# EAGLE schematic display driver rev A (EAGLE 9.3.1)
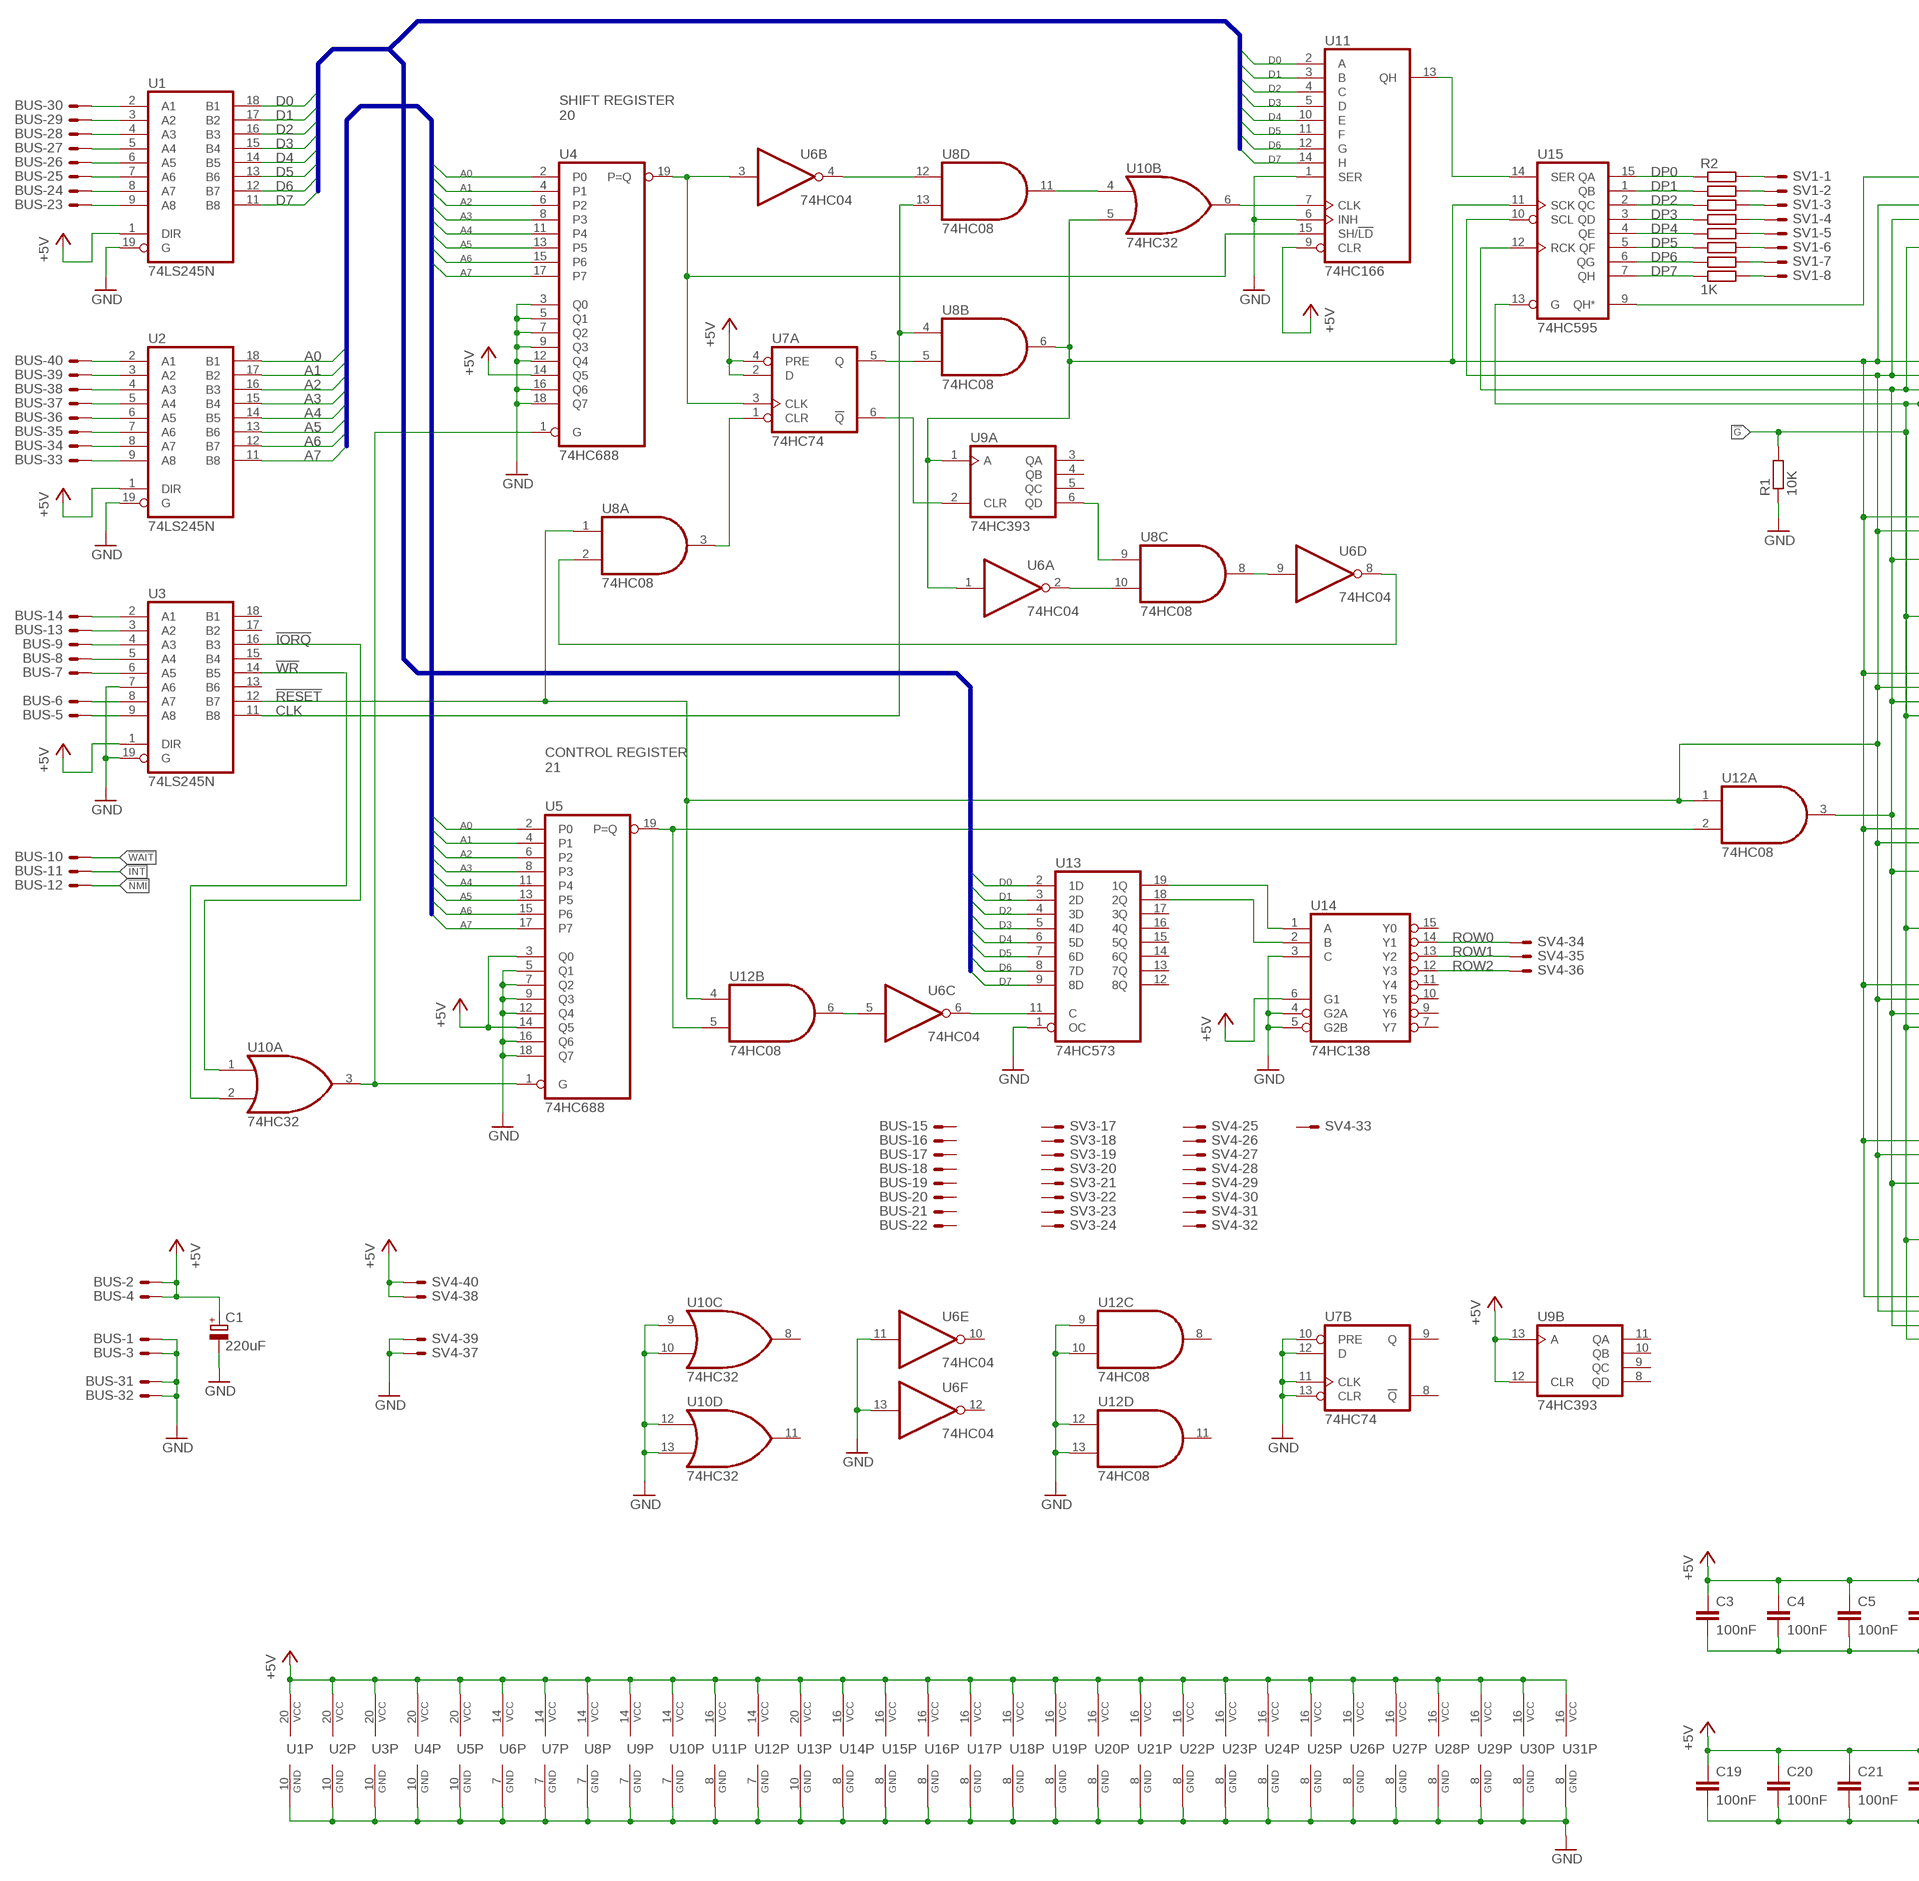
[diagram p0: schematic, sheet 1, part 1 of 2]
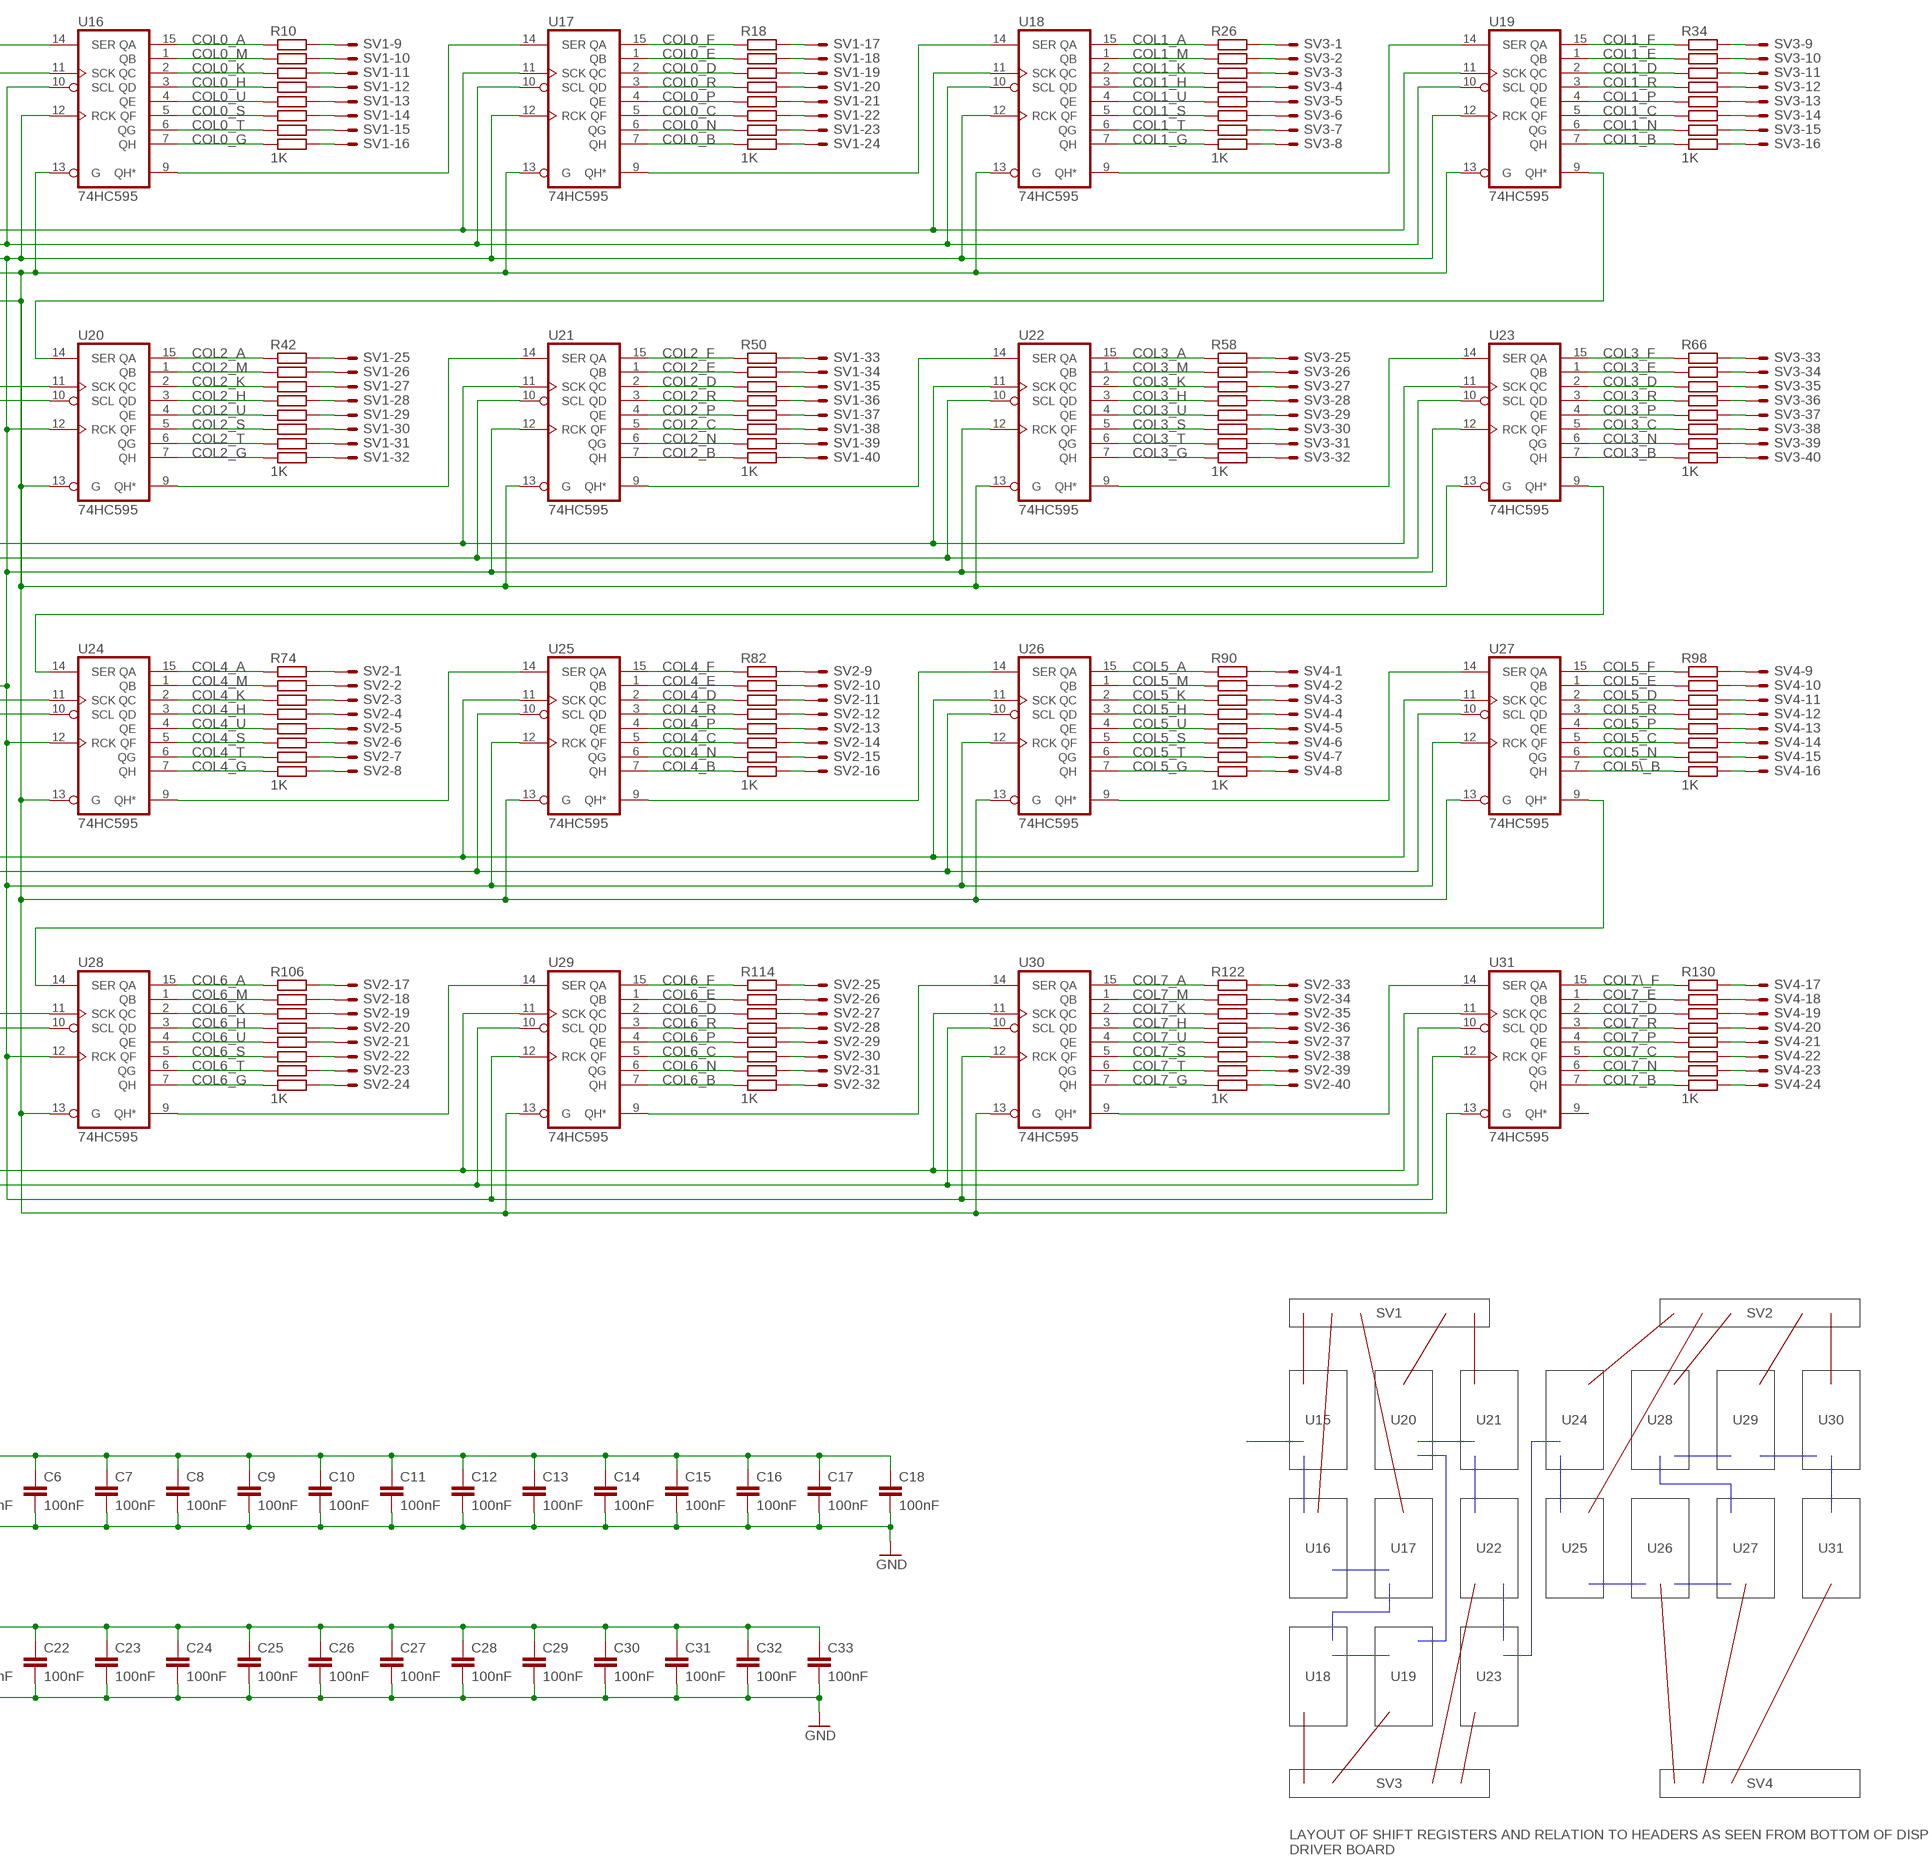
[diagram p1: schematic, sheet 1, part 2 of 2]

## Parts
BUS  ML40E  [ML40]
C1  220uF  CPOL-EUE3.5-8  [E3,5-8]
C3  100nF  C-EU050-025X075  [C050-025X075]
C4  100nF  C-EU050-025X075  [C050-025X075]
C5  100nF  C-EU050-025X075  [C050-025X075]
C6  100nF  C-EU050-025X075  [C050-025X075]
C7  100nF  C-EU050-025X075  [C050-025X075]
C8  100nF  C-EU050-025X075  [C050-025X075]
C9  100nF  C-EU050-025X075  [C050-025X075]
C10  100nF  C-EU050-025X075  [C050-025X075]
C11  100nF  C-EU050-025X075  [C050-025X075]
C12  100nF  C-EU050-025X075  [C050-025X075]
C13  100nF  C-EU050-025X075  [C050-025X075]
C14  100nF  C-EU050-025X075  [C050-025X075]
C15  100nF  C-EU050-025X075  [C050-025X075]
C16  100nF  C-EU050-025X075  [C050-025X075]
C17  100nF  C-EU050-025X075  [C050-025X075]
C18  100nF  C-EU050-025X075  [C050-025X075]
C19  100nF  C-EU050-025X075  [C050-025X075]
C20  100nF  C-EU050-025X075  [C050-025X075]
C21  100nF  C-EU050-025X075  [C050-025X075]
C22  100nF  C-EU050-025X075  [C050-025X075]
C23  100nF  C-EU050-025X075  [C050-025X075]
C24  100nF  C-EU050-025X075  [C050-025X075]
C25  100nF  C-EU050-025X075  [C050-025X075]
C26  100nF  C-EU050-025X075  [C050-025X075]
C27  100nF  C-EU050-025X075  [C050-025X075]
C28  100nF  C-EU050-025X075  [C050-025X075]
C29  100nF  C-EU050-025X075  [C050-025X075]
C30  100nF  C-EU050-025X075  [C050-025X075]
C31  100nF  C-EU050-025X075  [C050-025X075]
C32  100nF  C-EU050-025X075  [C050-025X075]
C33  100nF  C-EU050-025X075  [C050-025X075]
R1  10K  R-EU_0207/10  [0207/10]
R2  1K  R-EU_0207/10  [0207/10]
R3  1K  R-EU_0207/10  [0207/10]
R4  1K  R-EU_0207/10  [0207/10]
R5  1K  R-EU_0207/10  [0207/10]
R6  1K  R-EU_0207/10  [0207/10]
R7  1K  R-EU_0207/10  [0207/10]
R8  1K  R-EU_0207/10  [0207/10]
R9  1K  R-EU_0207/10  [0207/10]
R10  1K  R-EU_0207/10  [0207/10]
R11  1K  R-EU_0207/10  [0207/10]
R12  1K  R-EU_0207/10  [0207/10]
R13  1K  R-EU_0207/10  [0207/10]
R14  1K  R-EU_0207/10  [0207/10]
R15  1K  R-EU_0207/10  [0207/10]
R16  1K  R-EU_0207/10  [0207/10]
R17  1K  R-EU_0207/10  [0207/10]
R18  1K  R-EU_0207/10  [0207/10]
R19  1K  R-EU_0207/10  [0207/10]
R20  1K  R-EU_0207/10  [0207/10]
R21  1K  R-EU_0207/10  [0207/10]
R22  1K  R-EU_0207/10  [0207/10]
R23  1K  R-EU_0207/10  [0207/10]
R24  1K  R-EU_0207/10  [0207/10]
R25  1K  R-EU_0207/10  [0207/10]
R26  1K  R-EU_0207/10  [0207/10]
R27  1K  R-EU_0207/10  [0207/10]
R28  1K  R-EU_0207/10  [0207/10]
R29  1K  R-EU_0207/10  [0207/10]
R30  1K  R-EU_0207/10  [0207/10]
R31  1K  R-EU_0207/10  [0207/10]
R32  1K  R-EU_0207/10  [0207/10]
R33  1K  R-EU_0207/10  [0207/10]
R34  1K  R-EU_0207/10  [0207/10]
R35  1K  R-EU_0207/10  [0207/10]
R36  1K  R-EU_0207/10  [0207/10]
R37  1K  R-EU_0207/10  [0207/10]
R38  1K  R-EU_0207/10  [0207/10]
R39  1K  R-EU_0207/10  [0207/10]
R40  1K  R-EU_0207/10  [0207/10]
R41  1K  R-EU_0207/10  [0207/10]
R42  1K  R-EU_0207/10  [0207/10]
R43  1K  R-EU_0207/10  [0207/10]
R44  1K  R-EU_0207/10  [0207/10]
R45  1K  R-EU_0207/10  [0207/10]
R46  1K  R-EU_0207/10  [0207/10]
R47  1K  R-EU_0207/10  [0207/10]
R48  1K  R-EU_0207/10  [0207/10]
R49  1K  R-EU_0207/10  [0207/10]
R50  1K  R-EU_0207/10  [0207/10]
R51  1K  R-EU_0207/10  [0207/10]
R52  1K  R-EU_0207/10  [0207/10]
R53  1K  R-EU_0207/10  [0207/10]
R54  1K  R-EU_0207/10  [0207/10]
R55  1K  R-EU_0207/10  [0207/10]
R56  1K  R-EU_0207/10  [0207/10]
R57  1K  R-EU_0207/10  [0207/10]
R58  1K  R-EU_0207/10  [0207/10]
R59  1K  R-EU_0207/10  [0207/10]
R60  1K  R-EU_0207/10  [0207/10]
R61  1K  R-EU_0207/10  [0207/10]
R62  1K  R-EU_0207/10  [0207/10]
R63  1K  R-EU_0207/10  [0207/10]
R64  1K  R-EU_0207/10  [0207/10]
R65  1K  R-EU_0207/10  [0207/10]
R66  1K  R-EU_0207/10  [0207/10]
R67  1K  R-EU_0207/10  [0207/10]
R68  1K  R-EU_0207/10  [0207/10]
R69  1K  R-EU_0207/10  [0207/10]
R70  1K  R-EU_0207/10  [0207/10]
R71  1K  R-EU_0207/10  [0207/10]
R72  1K  R-EU_0207/10  [0207/10]
R73  1K  R-EU_0207/10  [0207/10]
R74  1K  R-EU_0207/10  [0207/10]
R75  1K  R-EU_0207/10  [0207/10]
R76  1K  R-EU_0207/10  [0207/10]
R77  1K  R-EU_0207/10  [0207/10]
R78  1K  R-EU_0207/10  [0207/10]
R79  1K  R-EU_0207/10  [0207/10]
R80  1K  R-EU_0207/10  [0207/10]
R81  1K  R-EU_0207/10  [0207/10]
R82  1K  R-EU_0207/10  [0207/10]
R83  1K  R-EU_0207/10  [0207/10]
R84  1K  R-EU_0207/10  [0207/10]
R85  1K  R-EU_0207/10  [0207/10]
R86  1K  R-EU_0207/10  [0207/10]
R87  1K  R-EU_0207/10  [0207/10]
R88  1K  R-EU_0207/10  [0207/10]
R89  1K  R-EU_0207/10  [0207/10]
R90  1K  R-EU_0207/10  [0207/10]
R91  1K  R-EU_0207/10  [0207/10]
R92  1K  R-EU_0207/10  [0207/10]
R93  1K  R-EU_0207/10  [0207/10]
R94  1K  R-EU_0207/10  [0207/10]
R95  1K  R-EU_0207/10  [0207/10]
R96  1K  R-EU_0207/10  [0207/10]
R97  1K  R-EU_0207/10  [0207/10]
R98  1K  R-EU_0207/10  [0207/10]
R99  1K  R-EU_0207/10  [0207/10]
R100  1K  R-EU_0207/10  [0207/10]
R101  1K  R-EU_0207/10  [0207/10]
R102  1K  R-EU_0207/10  [0207/10]
R103  1K  R-EU_0207/10  [0207/10]
R104  1K  R-EU_0207/10  [0207/10]
R105  1K  R-EU_0207/10  [0207/10]
R106  1K  R-EU_0207/10  [0207/10]
R107  1K  R-EU_0207/10  [0207/10]
R108  1K  R-EU_0207/10  [0207/10]
R109  1K  R-EU_0207/10  [0207/10]
R110  1K  R-EU_0207/10  [0207/10]
R111  1K  R-EU_0207/10  [0207/10]
R112  1K  R-EU_0207/10  [0207/10]
R113  1K  R-EU_0207/10  [0207/10]
R114  1K  R-EU_0207/10  [0207/10]
R115  1K  R-EU_0207/10  [0207/10]
R116  1K  R-EU_0207/10  [0207/10]
R117  1K  R-EU_0207/10  [0207/10]
R118  1K  R-EU_0207/10  [0207/10]
R119  1K  R-EU_0207/10  [0207/10]
R120  1K  R-EU_0207/10  [0207/10]
R121  1K  R-EU_0207/10  [0207/10]
R122  1K  R-EU_0207/10  [0207/10]
R123  1K  R-EU_0207/10  [0207/10]
R124  1K  R-EU_0207/10  [0207/10]
R125  1K  R-EU_0207/10  [0207/10]
R126  1K  R-EU_0207/10  [0207/10]
R127  1K  R-EU_0207/10  [0207/10]
R128  1K  R-EU_0207/10  [0207/10]
R129  1K  R-EU_0207/10  [0207/10]
R130  1K  R-EU_0207/10  [0207/10]
R131  1K  R-EU_0207/10  [0207/10]
R132  1K  R-EU_0207/10  [0207/10]
R133  1K  R-EU_0207/10  [0207/10]
R134  1K  R-EU_0207/10  [0207/10]
R135  1K  R-EU_0207/10  [0207/10]
R136  1K  R-EU_0207/10  [0207/10]
R137  1K  R-EU_0207/10  [0207/10]
SV1  ML40E  [ML40]
SV2  ML40E  [ML40]
SV3  ML40E  [ML40]
SV4  ML40E  [ML40]
U1  74LS245N  [DIL20]
U2  74LS245N  [DIL20]
U3  74LS245N  [DIL20]
U4  74HC688  74LS688N  [DIL20]
U5  74HC688  74LS688N  [DIL20]
U6  74HC04  74LS04N  [DIL14]
U7  74HC74  74LS74N  [DIL14]
U8  74HC08  74LS08N  [DIL14]
U9  74HC393  74LS393N  [DIL14]
U10  74HC32  74LS32N  [DIL14]
U11  74HC166  74LS166N  [DIL16]
U12  74HC08  74LS08N  [DIL14]
U13  74HC573  74HC573N  [DIL20]
U14  74HC138  74LS138N  [DIL16]
U15  74HC595  74LS595N  [DIL16]
U16  74HC595  74LS595N  [DIL16]
U17  74HC595  74LS595N  [DIL16]
U18  74HC595  74LS595N  [DIL16]
U19  74HC595  74LS595N  [DIL16]
U20  74HC595  74LS595N  [DIL16]
U21  74HC595  74LS595N  [DIL16]
U22  74HC595  74LS595N  [DIL16]
U23  74HC595  74LS595N  [DIL16]
U24  74HC595  74LS595N  [DIL16]
U25  74HC595  74LS595N  [DIL16]
U26  74HC595  74LS595N  [DIL16]
U27  74HC595  74LS595N  [DIL16]
U28  74HC595  74LS595N  [DIL16]
U29  74HC595  74LS595N  [DIL16]
U30  74HC595  74LS595N  [DIL16]
U31  74HC595  74LS595N  [DIL16]

## Nets
!G!: R1.2 U15.13(G) U16.13(G) U17.13(G) U18.13(G) U19.13(G) U20.13(G) U21.13(G) U22.13(G) U23.13(G) U24.13(G) U25.13(G) U26.13(G) U27.13(G) U28.13(G) U29.13(G) U30.13(G) U31.13(G)
!INT!: BUS.11
!IORQ!: U3.16(B3) U10.1(A:I0)
!NMI!: BUS.12
!RESET!: U3.12(B7) U8.1(A:I0) U12.1(A:I0) U12.4(B:I0) U15.10(SCL) U16.10(SCL) U17.10(SCL) U18.10(SCL) U19.10(SCL) U20.10(SCL) U21.10(SCL) U22.10(SCL) U23.10(SCL) U24.10(SCL) U25.10(SCL) U26.10(SCL) U27.10(SCL) U28.10(SCL) U29.10(SCL) U30.10(SCL) U31.10(SCL)
!WAIT!: BUS.10
!WR!: U3.14(B5) U10.2(A:I1)
+5V: BUS.2 BUS.4 C1.+ C3.1 C4.1 C5.1 C6.1 C7.1 C8.1 C9.1 C10.1 C11.1 C12.1 C13.1 C14.1 C15.1 C16.1 C17.1 C18.1 C19.1 C20.1 C21.1 C22.1 C23.1 C24.1 C25.1 C26.1 C27.1 C28.1 C29.1 C30.1 C31.1 C32.1 C33.1 SV4.38 SV4.40 U1.1(DIR) U1.20(VCC) U2.1(DIR) U2.20(VCC) U3.1(DIR) U3.20(VCC) U4.14(Q5) U4.20(VCC) U5.3(Q0) U5.14(Q5) U5.20(VCC) U6.14(P:VCC) U7.2(A:D) U7.4(A:PRE) U7.14(P:VCC) U8.14(P:VCC) U9.12(B:CLR) U9.13(B:A) U9.14(P:VCC) U10.14(P:VCC) U11.9(CLR) U11.16(VCC) U12.14(P:VCC) U13.20(VCC) U14.6(G1) U14.16(VCC) U15.16(VCC) U16.16(VCC) U17.16(VCC) U18.16(VCC) U19.16(VCC) U20.16(VCC) U21.16(VCC) U22.16(VCC) U23.16(VCC) U24.16(VCC) U25.16(VCC) U26.16(VCC) U27.16(VCC) U28.16(VCC) U29.16(VCC) U30.16(VCC) U31.16(VCC)
A0: U2.18(B1) U4.2(P0) U5.2(P0)
A1: U2.17(B2) U4.4(P1) U5.4(P1)
A2: U2.16(B3) U4.6(P2) U5.6(P2)
A3: U2.15(B4) U4.8(P3) U5.8(P3)
A4: U2.14(B5) U4.11(P4) U5.11(P4)
A5: U2.13(B6) U4.13(P5) U5.13(P5)
A6: U2.12(B7) U4.15(P6) U5.15(P6)
A7: U2.11(B8) U4.17(P7) U5.17(P7)
CLK: U3.11(B8) U8.4(B:I0) U8.13(D:I1)
COL0_A: R10.1 U16.15(QA)
COL0_B: R25.1 U17.7(QH)
COL0_C: R23.1 U17.5(QF)
COL0_D: R20.1 U17.2(QC)
COL0_E: R19.1 U17.1(QB)
COL0_F: R18.1 U17.15(QA)
COL0_G: R17.1 U16.7(QH)
COL0_H: R13.1 U16.3(QD)
COL0_K: R12.1 U16.2(QC)
COL0_M: R11.1 U16.1(QB)
COL0_N: R24.1 U17.6(QG)
COL0_P: R22.1 U17.4(QE)
COL0_R: R21.1 U17.3(QD)
COL0_S: R15.1 U16.5(QF)
COL0_T: R16.1 U16.6(QG)
COL0_U: R14.1 U16.4(QE)
COL1_A: R26.1 U18.15(QA)
COL1_B: R41.1 U19.7(QH)
COL1_C: R39.1 U19.5(QF)
COL1_D: R36.1 U19.2(QC)
COL1_E: R35.1 U19.1(QB)
COL1_F: R34.1 U19.15(QA)
COL1_G: R33.1 U18.7(QH)
COL1_H: R29.1 U18.3(QD)
COL1_K: R28.1 U18.2(QC)
COL1_M: R27.1 U18.1(QB)
COL1_N: R40.1 U19.6(QG)
COL1_P: R38.1 U19.4(QE)
COL1_R: R37.1 U19.3(QD)
COL1_S: R31.1 U18.5(QF)
COL1_T: R32.1 U18.6(QG)
COL1_U: R30.1 U18.4(QE)
COL2_A: R42.1 U20.15(QA)
COL2_B: R57.1 U21.7(QH)
COL2_C: R55.1 U21.5(QF)
COL2_D: R52.1 U21.2(QC)
COL2_E: R51.1 U21.1(QB)
COL2_F: R50.1 U21.15(QA)
COL2_G: R49.1 U20.7(QH)
COL2_H: R45.1 U20.3(QD)
COL2_K: R44.1 U20.2(QC)
COL2_M: R43.1 U20.1(QB)
COL2_N: R56.1 U21.6(QG)
COL2_P: R54.1 U21.4(QE)
COL2_R: R53.1 U21.3(QD)
COL2_S: R47.1 U20.5(QF)
COL2_T: R48.1 U20.6(QG)
COL2_U: R46.1 U20.4(QE)
COL3_A: R58.1 U22.15(QA)
COL3_B: R73.1 U23.7(QH)
COL3_C: R71.1 U23.5(QF)
COL3_D: R68.1 U23.2(QC)
COL3_E: R67.1 U23.1(QB)
COL3_F: R66.1 U23.15(QA)
COL3_G: R65.1 U22.7(QH)
COL3_H: R61.1 U22.3(QD)
COL3_K: R60.1 U22.2(QC)
COL3_M: R59.1 U22.1(QB)
COL3_N: R72.1 U23.6(QG)
COL3_P: R70.1 U23.4(QE)
COL3_R: R69.1 U23.3(QD)
COL3_S: R63.1 U22.5(QF)
COL3_T: R64.1 U22.6(QG)
COL3_U: R62.1 U22.4(QE)
COL4_A: R74.1 U24.15(QA)
COL4_B: R89.1 U25.7(QH)
COL4_C: R87.1 U25.5(QF)
COL4_D: R84.1 U25.2(QC)
COL4_E: R83.1 U25.1(QB)
COL4_F: R82.1 U25.15(QA)
COL4_G: R81.1 U24.7(QH)
COL4_H: R77.1 U24.3(QD)
COL4_K: R76.1 U24.2(QC)
COL4_M: R75.1 U24.1(QB)
COL4_N: R88.1 U25.6(QG)
COL4_P: R86.1 U25.4(QE)
COL4_R: R85.1 U25.3(QD)
COL4_S: R79.1 U24.5(QF)
COL4_T: R80.1 U24.6(QG)
COL4_U: R78.1 U24.4(QE)
COL5\_B: R105.1 U27.7(QH)
COL5_A: R90.1 U26.15(QA)
COL5_C: R103.1 U27.5(QF)
COL5_D: R100.1 U27.2(QC)
COL5_E: R99.1 U27.1(QB)
COL5_F: R98.1 U27.15(QA)
COL5_G: R97.1 U26.7(QH)
COL5_H: R93.1 U26.3(QD)
COL5_K: R92.1 U26.2(QC)
COL5_M: R91.1 U26.1(QB)
COL5_N: R104.1 U27.6(QG)
COL5_P: R102.1 U27.4(QE)
COL5_R: R101.1 U27.3(QD)
COL5_S: R95.1 U26.5(QF)
COL5_T: R96.1 U26.6(QG)
COL5_U: R94.1 U26.4(QE)
COL6_A: R106.1 U28.15(QA)
COL6_B: R121.1 U29.7(QH)
COL6_C: R119.1 U29.5(QF)
COL6_D: R116.1 U29.2(QC)
COL6_E: R115.1 U29.1(QB)
COL6_F: R114.1 U29.15(QA)
COL6_G: R113.1 U28.7(QH)
COL6_H: R109.1 U28.3(QD)
COL6_K: R108.1 U28.2(QC)
COL6_M: R107.1 U28.1(QB)
COL6_N: R120.1 U29.6(QG)
COL6_P: R118.1 U29.4(QE)
COL6_R: R117.1 U29.3(QD)
COL6_S: R111.1 U28.5(QF)
COL6_T: R112.1 U28.6(QG)
COL6_U: R110.1 U28.4(QE)
COL7\_F: R130.1 U31.15(QA)
COL7_A: R122.1 U30.15(QA)
COL7_B: R137.1 U31.7(QH)
COL7_C: R135.1 U31.5(QF)
COL7_D: R132.1 U31.2(QC)
COL7_E: R131.1 U31.1(QB)
COL7_G: R129.1 U30.7(QH)
COL7_H: R125.1 U30.3(QD)
COL7_K: R124.1 U30.2(QC)
COL7_M: R123.1 U30.1(QB)
COL7_N: R136.1 U31.6(QG)
COL7_P: R134.1 U31.4(QE)
COL7_R: R133.1 U31.3(QD)
COL7_S: R127.1 U30.5(QF)
COL7_T: R128.1 U30.6(QG)
COL7_U: R126.1 U30.4(QE)
D0: U1.18(B1) U11.2(A) U13.2(1D)
D1: U1.17(B2) U11.3(B) U13.3(2D)
D2: U1.16(B3) U11.4(C) U13.4(3D)
D3: U1.15(B4) U11.5(D) U13.5(4D)
D4: U1.14(B5) U11.10(E) U13.6(5D)
D5: U1.13(B6) U11.11(F) U13.7(6D)
D6: U1.12(B7) U11.12(G) U13.8(7D)
D7: U1.11(B8) U11.14(H) U13.9(8D)
DP0: R2.1 U15.15(QA)
DP1: R3.1 U15.1(QB)
DP2: R4.1 U15.2(QC)
DP3: R5.1 U15.3(QD)
DP4: R6.1 U15.4(QE)
DP5: R7.1 U15.5(QF)
DP6: R8.1 U15.6(QG)
DP7: R9.1 U15.7(QH)
GND: BUS.1 BUS.3 BUS.31 BUS.32 C1.- C3.2 C4.2 C5.2 C6.2 C7.2 C8.2 C9.2 C10.2 C11.2 C12.2 C13.2 C14.2 C15.2 C16.2 C17.2 C18.2 C19.2 C20.2 C21.2 C22.2 C23.2 C24.2 C25.2 C26.2 C27.2 C28.2 C29.2 C30.2 C31.2 C32.2 C33.2 R1.1 SV4.37 SV4.39 U1.10(GND) U1.19(G) U2.10(GND) U2.19(G) U3.7(A6) U3.10(GND) U3.19(G) U4.3(Q0) U4.5(Q1) U4.7(Q2) U4.9(Q3) U4.10(GND) U4.12(Q4) U4.16(Q6) U4.18(Q7) U5.5(Q1) U5.7(Q2) U5.9(Q3) U5.10(GND) U5.12(Q4) U5.16(Q6) U5.18(Q7) U6.7(P:GND) U6.11(E:I) U6.13(F:I) U7.7(P:GND) U7.10(B:PRE) U7.11(B:CLK) U7.12(B:D) U7.13(B:CLR) U8.7(P:GND) U9.7(P:GND) U10.7(P:GND) U10.9(C:I0) U10.10(C:I1) U10.12(D:I0) U10.13(D:I1) U11.1(SER) U11.6(INH) U11.8(GND) U12.7(P:GND) U12.9(C:I0) U12.10(C:I1) U12.12(D:I0) U12.13(D:I1) U13.1(OC) U13.10(GND) U14.3(C) U14.4(G2A) U14.5(G2B) U14.8(GND) U15.8(GND) U16.8(GND) U17.8(GND) U18.8(GND) U19.8(GND) U20.8(GND) U21.8(GND) U22.8(GND) U23.8(GND) U24.8(GND) U25.8(GND) U26.8(GND) U27.8(GND) U28.8(GND) U29.8(GND) U30.8(GND) U31.8(GND)
N$1: U4.1(G) U5.1(G) U10.3(A:O)
N$2: U4.19(P=Q) U6.3(B:I) U7.3(A:CLK) U11.15(SH/!LD)
N$3: U7.6(A:!Q) U9.2(A:CLR)
N$4: U7.1(A:CLR) U8.3(A:O)
N$5: U7.5(A:Q) U8.5(B:I1)
N$6: U6.1(A:I) U8.6(B:O) U9.1(A:A) U10.5(B:I1) U15.11(SCK) U16.11(SCK) U17.11(SCK) U18.11(SCK) U19.11(SCK) U20.11(SCK) U21.11(SCK) U22.11(SCK) U23.11(SCK) U24.11(SCK) U25.11(SCK) U26.11(SCK) U27.11(SCK) U28.11(SCK) U29.11(SCK) U30.11(SCK) U31.11(SCK)
N$7: U6.2(A:O) U8.10(C:I1)
N$8: U8.9(C:I0) U9.6(A:QD)
N$9: U6.9(D:I) U8.8(C:O)
N$10: U6.4(B:O) U8.12(D:I0)
N$11: U6.8(D:O) U8.2(A:I1)
N$12: U10.6(B:O) U11.7(CLK)
N$13: U6.6(C:O) U13.11(C)
N$14: U8.11(D:O) U10.4(B:I0)
N$15: U5.19(P=Q) U12.2(A:I1) U12.5(B:I1)
N$16: U6.5(C:I) U12.6(B:O)
N$17: U13.19(1Q) U14.1(A)
N$18: U13.18(2Q) U14.2(B)
N$19: BUS.23 U1.9(A8)
N$20: BUS.24 U1.8(A7)
N$21: U11.13(QH) U15.14(SER)
N$22: BUS.25 U1.7(A6)
N$23: BUS.26 U1.6(A5)
N$24: U15.9(QH*) U16.14(SER)
N$25: U19.9(QH*) U20.14(SER)
N$26: BUS.27 U1.5(A4)
N$27: U12.3(A:O) U15.12(RCK) U16.12(RCK) U17.12(RCK) U18.12(RCK) U19.12(RCK) U20.12(RCK) U21.12(RCK) U22.12(RCK) U23.12(RCK) U24.12(RCK) U25.12(RCK) U26.12(RCK) U27.12(RCK) U28.12(RCK) U29.12(RCK) U30.12(RCK) U31.12(RCK)
N$28: BUS.28 U1.4(A3)
N$29: U16.9(QH*) U17.14(SER)
N$30: U23.9(QH*) U24.14(SER)
N$31: U27.9(QH*) U28.14(SER)
N$32: BUS.29 U1.3(A2)
N$33: BUS.30 U1.2(A1)
N$34: U17.9(QH*) U18.14(SER)
N$35: U18.9(QH*) U19.14(SER)
N$36: BUS.33 U2.9(A8)
N$37: BUS.34 U2.8(A7)
N$38: BUS.35 U2.7(A6)
N$39: BUS.36 U2.6(A5)
N$40: BUS.37 U2.5(A4)
N$41: U20.9(QH*) U21.14(SER)
N$42: BUS.38 U2.4(A3)
N$43: BUS.39 U2.3(A2)
N$44: BUS.40 U2.2(A1)
N$45: BUS.14 U3.2(A1)
N$46: U21.9(QH*) U22.14(SER)
N$47: U22.9(QH*) U23.14(SER)
N$48: BUS.13 U3.3(A2)
N$49: BUS.9 U3.4(A3)
N$50: BUS.8 U3.5(A4)
N$51: BUS.7 U3.6(A5)
N$52: BUS.6 U3.8(A7)
N$53: U24.9(QH*) U25.14(SER)
N$54: BUS.5 U3.9(A8)
N$55: R2.2 SV1.1
N$56: R3.2 SV1.2
N$57: R4.2 SV1.3
N$58: U25.9(QH*) U26.14(SER)
N$59: U26.9(QH*) U27.14(SER)
N$60: R5.2 SV1.4
N$61: R6.2 SV1.5
N$62: R7.2 SV1.6
N$63: R8.2 SV1.7
N$64: R9.2 SV1.8
N$65: U28.9(QH*) U29.14(SER)
N$66: R10.2 SV1.9
N$67: R11.2 SV1.10
N$68: R12.2 SV1.11
N$69: R13.2 SV1.12
N$70: U29.9(QH*) U30.14(SER)
N$71: U30.9(QH*) U31.14(SER)
N$72: R14.2 SV1.13
N$73: R15.2 SV1.14
N$74: R16.2 SV1.15
N$75: R17.2 SV1.16
N$76: R18.2 SV1.17
N$77: R19.2 SV1.18
N$78: R20.2 SV1.19
N$79: R21.2 SV1.20
N$80: R22.2 SV1.21
N$81: R23.2 SV1.22
N$82: R24.2 SV1.23
N$83: R25.2 SV1.24
N$84: R26.2 SV3.1
N$85: R27.2 SV3.2
N$86: R28.2 SV3.3
N$87: R29.2 SV3.4
N$88: R30.2 SV3.5
N$89: R31.2 SV3.6
N$90: R32.2 SV3.7
N$91: R33.2 SV3.8
N$92: R34.2 SV3.9
N$93: R35.2 SV3.10
N$94: R36.2 SV3.11
N$95: R37.2 SV3.12
N$96: R38.2 SV3.13
N$97: R39.2 SV3.14
N$98: R40.2 SV3.15
N$99: R41.2 SV3.16
N$100: R42.2 SV1.25
N$101: R43.2 SV1.26
N$102: R44.2 SV1.27
N$103: R45.2 SV1.28
N$104: R46.2 SV1.29
N$105: R47.2 SV1.30
N$106: R48.2 SV1.31
N$107: R49.2 SV1.32
N$108: R74.2 SV2.1
N$109: R75.2 SV2.2
N$110: R76.2 SV2.3
N$111: R77.2 SV2.4
N$112: R78.2 SV2.5
N$113: R79.2 SV2.6
N$114: R80.2 SV2.7
N$115: R81.2 SV2.8
N$116: R58.2 SV3.25
N$117: R59.2 SV3.26
N$118: R60.2 SV3.27
N$119: R61.2 SV3.28
N$120: R62.2 SV3.29
N$121: R63.2 SV3.30
N$122: R64.2 SV3.31
N$123: R65.2 SV3.32
N$124: R50.2 SV1.33
N$125: R51.2 SV1.34
N$126: R52.2 SV1.35
N$127: R53.2 SV1.36
N$128: R54.2 SV1.37
N$129: R55.2 SV1.38
N$130: R56.2 SV1.39
N$131: R57.2 SV1.40
N$132: R66.2 SV3.33
N$133: R67.2 SV3.34
N$134: R68.2 SV3.35
N$135: R69.2 SV3.36
N$136: R70.2 SV3.37
N$137: R71.2 SV3.38
N$138: R72.2 SV3.39
N$139: R73.2 SV3.40
N$140: R82.2 SV2.9
N$141: R83.2 SV2.10
N$142: R84.2 SV2.11
N$143: R85.2 SV2.12
N$144: R86.2 SV2.13
N$145: R87.2 SV2.14
N$146: R88.2 SV2.15
N$147: R89.2 SV2.16
N$148: R90.2 SV4.1
N$149: R91.2 SV4.2
N$150: R92.2 SV4.3
N$151: R93.2 SV4.4
N$152: R94.2 SV4.5
N$153: R95.2 SV4.6
N$154: R96.2 SV4.7
N$155: R97.2 SV4.8
N$156: R98.2 SV4.9
N$157: R99.2 SV4.10
N$158: R100.2 SV4.11
N$159: R101.2 SV4.12
N$160: R102.2 SV4.13
N$161: R103.2 SV4.14
N$162: R104.2 SV4.15
N$163: R105.2 SV4.16
N$164: R106.2 SV2.17
N$165: R107.2 SV2.18
N$166: R108.2 SV2.19
N$167: R109.2 SV2.20
N$168: R110.2 SV2.21
N$169: R111.2 SV2.22
N$170: R112.2 SV2.23
N$171: R113.2 SV2.24
N$172: R114.2 SV2.25
N$173: R115.2 SV2.26
N$174: R116.2 SV2.27
N$175: R117.2 SV2.28
N$176: R118.2 SV2.29
N$177: R119.2 SV2.30
N$178: R120.2 SV2.31
N$179: R121.2 SV2.32
N$180: R122.2 SV2.33
N$181: R123.2 SV2.34
N$182: R124.2 SV2.35
N$183: R125.2 SV2.36
N$184: R126.2 SV2.37
N$185: R127.2 SV2.38
N$186: R128.2 SV2.39
N$187: R129.2 SV2.40
N$188: R130.2 SV4.17
N$189: R131.2 SV4.18
N$190: R132.2 SV4.19
N$191: R133.2 SV4.20
N$192: R134.2 SV4.21
N$193: R135.2 SV4.22
N$194: R136.2 SV4.23
N$195: R137.2 SV4.24
ROW0: SV4.34 U14.14(Y1)
ROW1: SV4.35 U14.13(Y2)
ROW2: SV4.36 U14.12(Y3)
Unconnected: BUS.15 BUS.16 BUS.17 BUS.18 BUS.19 BUS.20 BUS.21 BUS.22 SV3.17 SV3.18 SV3.19 SV3.20 SV3.21 SV3.22 SV3.23 SV3.24 SV4.25 SV4.26 SV4.27 SV4.28 SV4.29 SV4.30 SV4.31 SV4.32 SV4.33 U3.13(B6) U3.15(B4) U3.17(B2) U3.18(B1) U6.10(E:O) U6.12(F:O) U7.8(B:!Q) U7.9(B:Q) U9.3(A:QA) U9.4(A:QB) U9.5(A:QC) U9.8(B:QD) U9.9(B:QC) U9.10(B:QB) U9.11(B:QA) U10.8(C:O) U10.11(D:O) U12.8(C:O) U12.11(D:O) U13.12(8Q) U13.13(7Q) U13.14(6Q) U13.15(5Q) U13.16(4Q) U13.17(3Q) U14.7(Y7) U14.9(Y6) U14.10(Y5) U14.11(Y4) U14.15(Y0) U31.9(QH*)

## Buses
Z80DATA:D[0..7]
Z80ADDRESS:A[0..15]

## Notes on the sheet
- SHIFT REGISTER
  20
- CONTROL REGISTER
  21
- SV1 | SV2
- U15 | U20 | U21 | U24 | U28 | U29 | U30
- U16 | U17 | U22 | U25 | U26 | U27 | U31
- U18 | U19 | U23
- SV3 | SV4
- LAYOUT OF SHIFT REGISTERS AND RELATION TO HEADERS AS SEEN FROM BOTTOM OF DISPLAY
  DRIVER BOARD

## Library data of the parts
BUS SV1-SV4 = con-ml:ML40E: HARTING; OC_FARNELL: unknown; OC_NEWARK: unknown
C1 = rcl:CPOL-EU: POLARIZED CAPACITOR, European symbol
C3-C33 = rcl:C-EU: CAPACITOR, European symbol
R1-R137 = rcl:R-EU_: RESISTOR, European symbol
U1-U3 = 74xx-us:74*245: Octal BUS TRANSCEIVER, 3-state
U4 U5 = 74xx-us:74*688: 8-bit MAGNITUDE/IDENTITY COMPARATOR, totem pole
U6 = 74xx-us:74*04: Hex INVERTER
U7 = 74xx-us:74*74: Dual D type positive edge triggered FLIP FLOP, preset and clear
U8 = 74xx-us:74*08: Quad 2-input AND gate
U9 = 74xx-us:74*393: Dual 4-bit decade and binary COUNTER
U10 = 74xx-us:74*32: Quad 2-input OR gate
U11 = 74xx-us:74*166: 8-bit parallel load SHIFT REGISTER
U12 = 74xx-us:74*08: Quad 2-input AND gate; SPICEPREFIX: J
U13 = 74xx-us:74*573: 8-bit D latch BUS DRIVER
U14 = 74xx-us:74*138: 3-line to 8-line DECODER/DEMULTIPLEXER
U15-U31 = 74xx-us:74*595: 8-bit SHIFT REGISTER, output latch